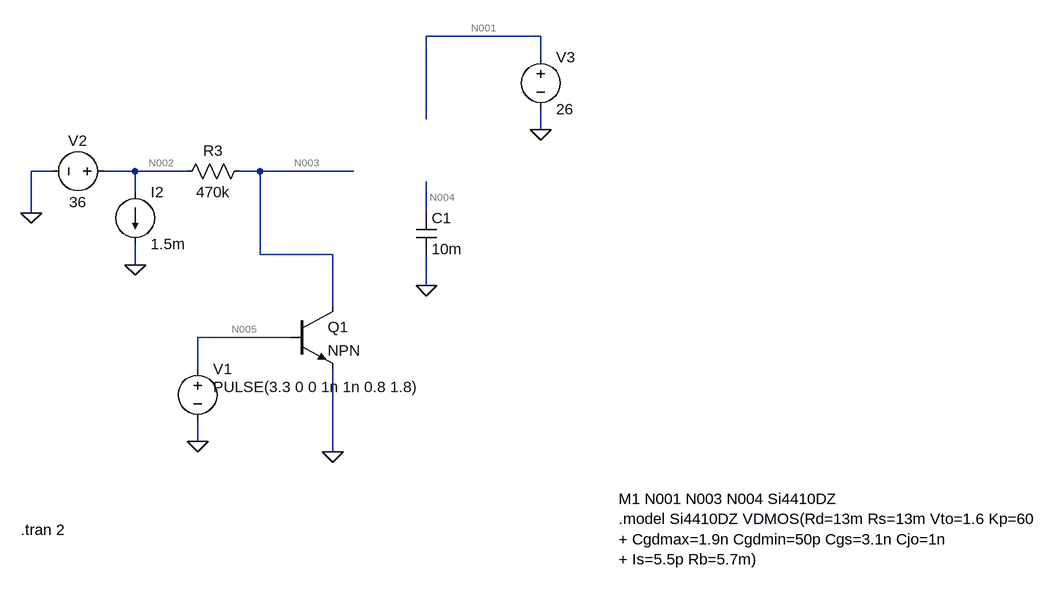
[diagram p0: schematic driver.asc]
driver.asc, the LTspice schematic file:
Version 4.1
SHEET 1 1236 680
WIRE 416 -384 240 -384
WIRE 416 -352 416 -384
WIRE 240 -256 240 -384
WIRE 416 -240 416 -272
WIRE -336 -176 -368 -176
WIRE -208 -176 -256 -176
WIRE -128 -176 -208 -176
WIRE -16 -176 -48 -176
WIRE 128 -176 -16 -176
WIRE -208 -144 -208 -176
WIRE -368 -112 -368 -176
WIRE 240 -112 240 -160
WIRE -16 -48 -16 -176
WIRE 96 -48 -16 -48
WIRE -208 -32 -208 -64
WIRE 240 0 240 -48
WIRE 96 32 96 -48
WIRE 32 80 -112 80
WIRE -112 128 -112 80
WIRE -112 240 -112 208
WIRE 96 256 96 128
FLAG -112 240 0
FLAG 96 256 0
FLAG -368 -112 0
FLAG -208 -32 0
FLAG 416 -240 0
FLAG 240 0 0
SYMBOL npn 32 32 R0
SYMATTR InstName Q1
SYMBOL voltage -112 112 R0
WINDOW 123 0 0 Left 0
WINDOW 39 0 0 Left 0
WINDOW 3 24 44 Left 2
SYMATTR InstName V1
SYMATTR Value PULSE(3.3 0 0 1n 1n 0.8 1.8)
SYMBOL res -32 -192 R90
WINDOW 0 0 56 VBottom 2
WINDOW 3 32 56 VTop 2
SYMATTR InstName R3
SYMATTR Value 470k
SYMBOL voltage -240 -176 R90
WINDOW 0 -32 56 VBottom 2
WINDOW 3 32 56 VTop 2
WINDOW 123 0 0 Left 0
WINDOW 39 0 0 Left 0
SYMATTR InstName V2
SYMATTR Value 36
SYMBOL voltage 416 -368 R0
WINDOW 123 0 0 Left 0
WINDOW 39 0 0 Left 0
SYMATTR InstName V3
SYMATTR Value 26
SYMBOL current -208 -144 R0
WINDOW 123 0 0 Left 0
WINDOW 39 0 0 Left 0
SYMATTR InstName I2
SYMATTR Value 1.5m
SYMBOL cap 224 -112 R0
SYMATTR InstName C1
SYMATTR Value 10m
TEXT 536 328 Left 2 !M1 N001 N003 N004 Si4410DZ\n.model Si4410DZ VDMOS(Rd=13m Rs=13m Vto=1.6 Kp=60\n+ Cgdmax=1.9n Cgdmin=50p Cgs=3.1n Cjo=1n\n+ Is=5.5p Rb=5.7m)
TEXT -384 376 Left 2 !.tran 2

The netlist it stands for:
* driver.asc
Q1 N003 N005 0 0 NPN
V1 N005 0 PULSE(3.3 0 0 1n 1n 0.8 1.8)
R3 N003 N002 470k
V2 N002 0 36
V3 N001 0 26
I2 N002 0 1.5m
C1 N004 0 10m
.model NPN NPN
.model PNP PNP
.lib standard.bjt
M1 N001 N003 N004 Si4410DZ
.model Si4410DZ VDMOS(Rd=13m Rs=13m Vto=1.6 Kp=60
+ Cgdmax=1.9n Cgdmin=50p Cgs=3.1n Cjo=1n
+ Is=5.5p Rb=5.7m)
.tran 2
.backanno
.end

* Results of the author's LTspice run, read from the files saved beside the schematic
* Operating Point, zero values left out:
*   V(n005) = 3.3 V
*   V(n001) = 26 V
*   V(n004) = 26.03 V
*   V(n003) = 876.4 mV
*   V(n002) = 36 V
*   Ic(Q1) = 366.2 µA
*   Ib(Q1) = 893.9 GA
*   Ie(Q1) = -893.9 GA
*   I(R3) = -74.73 µA
*   I(I2) = 1.5 mA
*   I(V1) = -893.9 GA
*   I(V2) = -1.575 mA
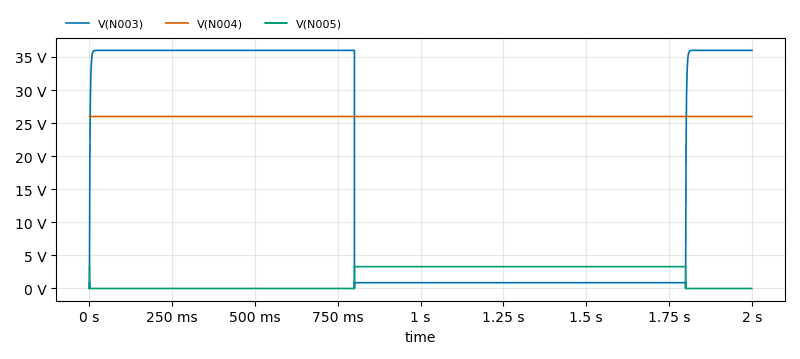
[diagram p1: Transient Analysis of driver.asc, plotted from the saved traces]
* Transient Analysis, 1 run:
*   V(N003): min -47.51 mV, max 36 V, average 18.38 V, rms 25.39 V, last 36 V
*   V(N004): min 26 V, max 26.03 V, average 26 V, rms 26 V, last 26 V
*   V(N005): min 0 V, max 3.3 V, average 1.65 V, rms 2.333 V, last 0 V